# Altium schematic sheet CATS-Vega-USB.SchDoc: CATS Vega
size A4; DocumentNumber: Overview; Revision: V1.0; SheetNumber: 4; SheetTotal: 16; Author: Luca Jost; Subtitle: USB Connector
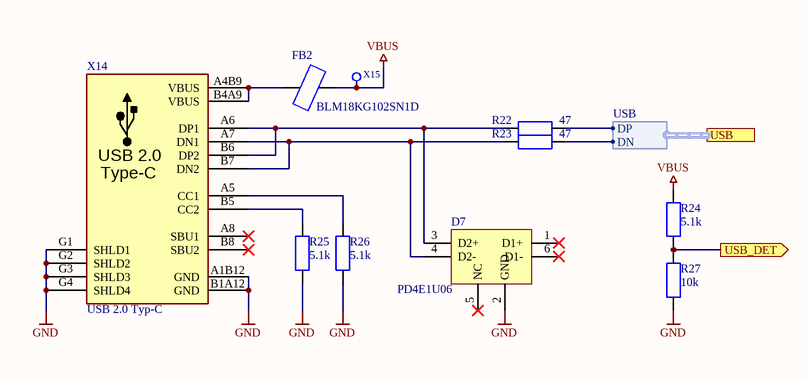
[diagram p0: CATS-Vega-USB.SchDoc]

## Parts
D7  PD4E1U06  [SMD IC SOT-363 (SC-70-6)]
FB2  BLM18KG102SN1D  [SMD Ferrite Bead 0603]
R22  47  [SMD Widerstand 0603]
R23  47  [SMD Widerstand 0603]
R24  5.1k  [SMD Widerstand 0603]
R25  5.1k  [SMD Widerstand 0603]
R26  5.1k  [SMD Widerstand 0603]
R27  10k  [SMD Widerstand 0603]
X14  USB 2.0 Typ-C  [THT USB-C Socket (A40-00119)]
X15  -  [SMD Test point 0.8mm]  (value not drawn)  (no BOM)

## Ports
USB (harness USB), USB_DET (out)

## Harnesses
USB: DP, DN

## Nets
GND: D7.2(GND) R25.1 R26.1 R27.2 X14.A1B12(GND) X14.B1A12(GND) X14.G1(SHLD1) X14.G2(SHLD2) X14.G3(SHLD3) X14.G4(SHLD4)
VBUS: FB2.1 R24.1 X15.1
USB_DET: R24.2 R27.1 ; port USB_DET
NetD7_3: D7.3(D2+) R22.1 X14.A6(DP1) X14.B6(DP2)
NetD7_4: D7.4(D2-) R23.1 X14.A7(DN1) X14.B7(DN2)
NetFB2_2: FB2.2 X14.A4B9(VBUS) X14.B4A9(VBUS)
NetR22_2: R22.2 ; port USB.DP
NetR23_2: R23.2 ; port USB.DN
NetR25_2: R25.2 X14.B5(CC2)
NetR26_2: R26.2 X14.A5(CC1)

Not connected (* = marked no-connect by the designer): D7 1(D1+)* 5(NC)* 6(D1-)*; X14 A8(SBU1)* B8(SBU2)*

## Notes on the sheet
- Title
- Author:
- Subtitle
- Date:
- Rev:
- File:
- Sheet
- of
- (in symbol USB Type-C USB 2.0) USB 2.0; Type-C

## Library data of the parts
D7 = PD4E1U06DCKR: Unidirectional 3A (8/20us) 15V (Typ) 6.5V 5.5V (Max) SOT-363 ESD Protection Devices ROHS; ComponentLink1Description: Datasheet; ComponentLink1URL: https://datasheet.lcsc.com/lcsc/1810172210_Texas-Instruments-TPD4E1U06DCKR_C194628.pdf; Digikey: 296-39347-1-ND; Farnell: 3116516; JLC: C194628; Mouser: 595-TPD4E1U06DCKR; Unit Price: 0.0382
FB2 = BLM18KG102SN1D: 1 kOhms @ 100MHz 1 Power Line Ferrite Bead 0603 (1608 Metric) 1A 200mOhm; ComponentLink1Description: Datasheet; ComponentLink1URL: https://www.murata.com/en-us/products/productdata/8796738650142/ENFA0003.pdf; Digikey: 490-17349-1-ND; JLC: C42102; Unit Price: 0.0058
R22 R23 = E24 - 47: SMD Chip Resistor E24; Unit Price: 0.001; JLC: C1211
R24-R26 = E24 - 5.1k: SMD Chip Resistor E24; Unit Price: 0.001; JLC: C2907114
R27 = E24 - 10k: SMD Chip Resistor E24; Unit Price: 0.001; JLC: C99198
X14 = USB Type-C USB 2.0: Typ-C; Digikey: 2073-USB4105-GF-ACT-ND; Farnell: 3583366; JLC: C167321; Unit Price: 0.2741
X15 = SMD Test point: Test Point SMD